# Altium schematic sheet 05_CONNECTOR_IN.SchDoc
size 420 x 297 mm; SheetNumber: 5; SheetTotal: 36
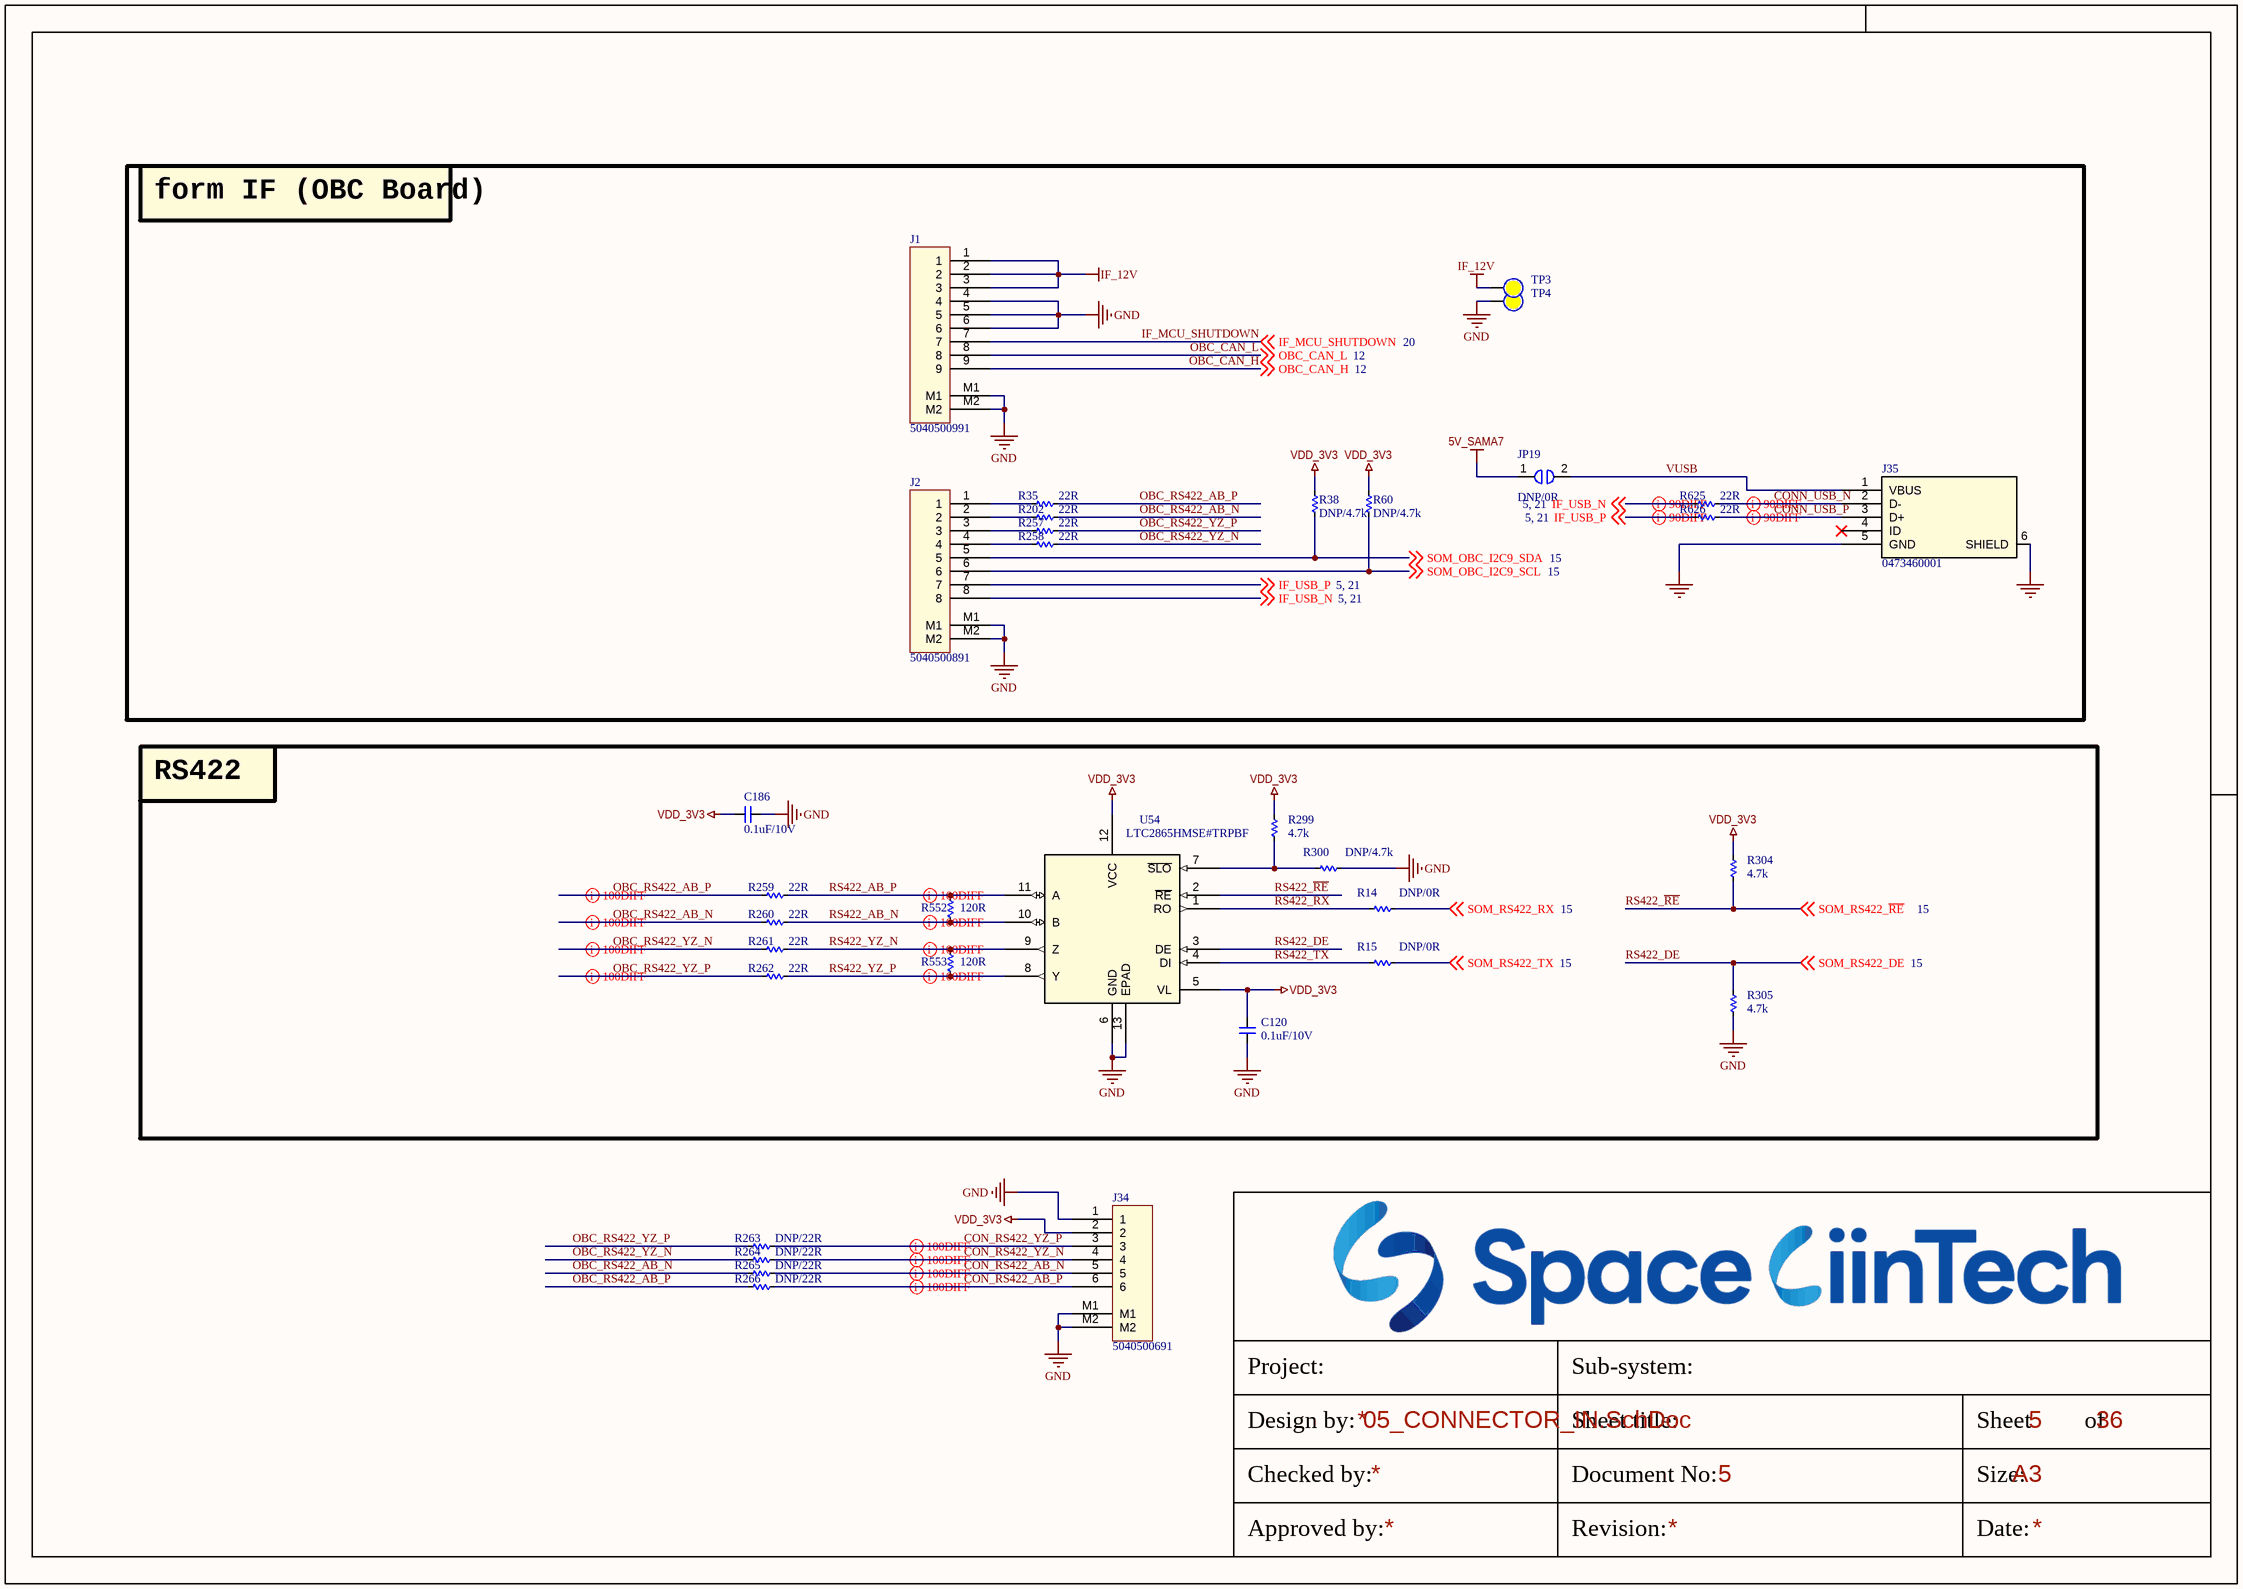
[diagram p0: 05_CONNECTOR_IN.SchDoc]

## Parts
C120  0.1uF/10V  [CAP_C_1005X60]
C186  0.1uF/10V  [CAP_C_1005X60]
J1  5040500991  [MOLEX_5040500991]
J2  5040500891  [MOLEX_5040500891]
J34  5040500691  [MOLEX_5040500691]
J35  0473460001  [47346-0001_MOL]
JP19  DNP/0R  [RES_C_1608X60]
R14  DNP/0R  [RES_C_1005X40]
R15  DNP/0R  [RES_C_1005X40]
R35  22R  [RES_C_1005X40]
R38  DNP/4.7k  [RES_C_1005X40]
R60  DNP/4.7k  [RES_C_1005X40]
R202  22R  [RES_C_1005X40]
R257  22R  [RES_C_1005X40]
R258  22R  [RES_C_1005X40]
R259  22R  [RES_C_1005X40]
R260  22R  [RES_C_1005X40]
R261  22R  [RES_C_1005X40]
R262  22R  [RES_C_1005X40]
R263  DNP/22R  [RES_C_1005X40]
R264  DNP/22R  [RES_C_1005X40]
R265  DNP/22R  [RES_C_1005X40]
R266  DNP/22R  [RES_C_1005X40]
R299  4.7k  [RES_C_1005X40]
R300  DNP/4.7k  [RES_C_1005X40]
R304  4.7k  [RES_C_1005X40]
R305  4.7k  [RES_C_1005X40]
R552  120R  [RES_C_1005X40]
R553  120R  [RES_C_1005X40]
R625  22R  [RES_C_1005X40]
R626  22R  [RES_C_1005X40]
TP3  (no value)  [Testpoint_TH_D130H80]  (no BOM)
TP4  (no value)  [Testpoint_TH_D130H80]  (no BOM)
U54  LTC2865HMSE#TRPBF  [MSOP-12_MSE_LIT]

## Blocks framed on the sheet
form IF (OBC Board): J1 J2 J35 JP19 R35 R38 R60 R202 R257 R258 R625 R626 TP3 TP4
RS422: C120 C186 R14 R15 R259-R262 R299 R300 R304 R305 R552 R553 U54

## Nets
5V_SAMA7: JP19.1
GND: C120.1 C186.1 J1.4 J1.5 J1.6 J1.M1 J1.M2 J2.M1 J2.M2 J34.1 J34.M1 J34.M2 J35.5(GND) J35.6(SHIELD) R300.2 R305.1 TP4.1 U54.6(GND) U54.13(EPAD)
IF_12V: J1.1 J1.2 J1.3 TP3.1
VDD_3V3: C120.2 C186.2 J34.2 R38.1 R60.1 R299.1 R304.1 U54.5(VL) U54.12(VCC)
CON_RS422_AB_N: J34.5 R265.2
CON_RS422_AB_P: J34.6 R266.2
CON_RS422_YZ_N: J34.4 R264.2
CON_RS422_YZ_P: J34.3 R263.2
CONN_USB_N: J35.2(D-) R625.2
CONN_USB_P: J35.3(D+) R626.2
IF_MCU_SHUTDOWN: J1.7 ; off-sheet IF_MCU_SHUTDOWN
IF_USB_N: J2.8 R625.1 ; off-sheet IF_USB_N
IF_USB_P: J2.7 R626.1 ; off-sheet IF_USB_P
OBC_CAN_H: J1.9 ; off-sheet OBC_CAN_H
OBC_CAN_L: J1.8 ; off-sheet OBC_CAN_L
OBC_RS422_AB_N: R202.2 R260.1 R265.1
OBC_RS422_AB_P: R35.2 R259.1 R266.1
OBC_RS422_YZ_N: R258.2 R261.1 R264.1
OBC_RS422_YZ_P: R257.2 R262.1 R263.1
RS422_AB_N: R260.2 R552.2 U54.10(B)
RS422_AB_P: R259.2 R552.1 U54.11(A)
RS422_DE: R305.2 U54.3(DE) ; off-sheet SOM_RS422_DE  [also labelled SOM_RS422_DE]
RS422_~{RE}: R304.2 U54.2(~{RE}) ; off-sheet SOM_RS422_~{RE}  [also labelled SOM_RS422_~{RE}]
RS422_RX: R14.1 U54.1(RO)
RS422_TX: R15.1 U54.4(DI)
RS422_YZ_N: R261.2 R553.1 U54.9(Z)
RS422_YZ_P: R262.2 R553.2 U54.8(Y)
SOM_OBC_I2C9_SCL: J2.6 R60.2 ; off-sheet SOM_OBC_I2C9_SCL
SOM_OBC_I2C9_SDA: J2.5 R38.2 ; off-sheet SOM_OBC_I2C9_SDA
SOM_RS422_RX: R14.2 ; off-sheet SOM_RS422_RX
SOM_RS422_TX: R15.2 ; off-sheet SOM_RS422_TX
VUSB: J35.1(VBUS) JP19.2
NetJ2_1: J2.1 R35.1
NetJ2_2: J2.2 R202.1
NetJ2_3: J2.3 R257.1
NetJ2_4: J2.4 R258.1
NetR299_2: R299.2 R300.1 U54.7(~{SLO})

Not connected (* = marked no-connect by the designer): J35 4(ID)*

## Layout directives
differential pair; differential pair class DIFF90: CONN_USB_N, CONN_USB_P, IF_USB_N, IF_USB_P
differential pair; differential pair class DIFF100: CON_RS422_AB_N, CON_RS422_AB_P, CON_RS422_YZ_N, CON_RS422_YZ_P, OBC_RS422_AB_N, OBC_RS422_AB_P, OBC_RS422_YZ_N, OBC_RS422_YZ_P, RS422_AB_N, RS422_AB_P, RS422_YZ_N, RS422_YZ_P

## Notes on the sheet
- Project:
- Sub-system:
- Design by:
- Sheet title:
- Sheet
- of
- Checked by:
- Approved by:
- Revision:
- Document No:
- Size:
- Date:
- A3

## Library data of the parts
C120 C186 = _CAP_C_2: CAP CHIP
J1 = Header 9x1_2M
J2 = Header 8x1_2M
J34 = Header 6x1_2M
J35 = USB_micro: No Description Available; Mfr_Name: Molex Connector Corporation; RefDes: RefDes; Type: Type
JP19 = JUMPER_1_1
R14 R15 R35 R38 R60 R202 R257-R266 R299 R300 R304 R305 R552 R553 R625 R626 = _RES_B_2: RES
TP3 TP4 = Test Point: Solder: NF
U54 = LTC2865HMSETRPBF: Â±60V Fault Protected 3V to 5.5V RS485/RS422 Transceivers; Manufacturer_Name: Analog Devices Inc; Copyright: Copyright (C) 2025 Ultra Librarian. All rights reserved.; Manufacturer_Part_Number: LTC2865HMSE#TRPBF; RefDes: RefDes; Type: Type